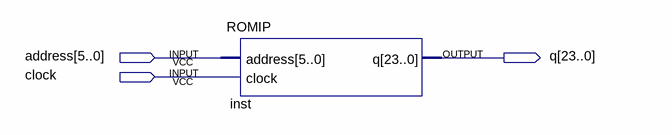
[diagram p0: schematic sheet]
// Quartus schematic ROM.bdf as structural Verilog: 1 symbols, 3 pins
module ROM (
  input  [5:0] address,
  input  clock,
  output [23:0] q
);

  ROMIP inst (.address(address), .clock(clock), .q(q));
endmodule
